# Altium project ESP32SSMB V1.4 .PrjPcb (part 2 of 2)

## Sheet ESP32.SchDoc: ESP32 S3 Schematic
size A3; ApprovedBy: TVBac; SheetNumber: 2; SheetTotal: 6
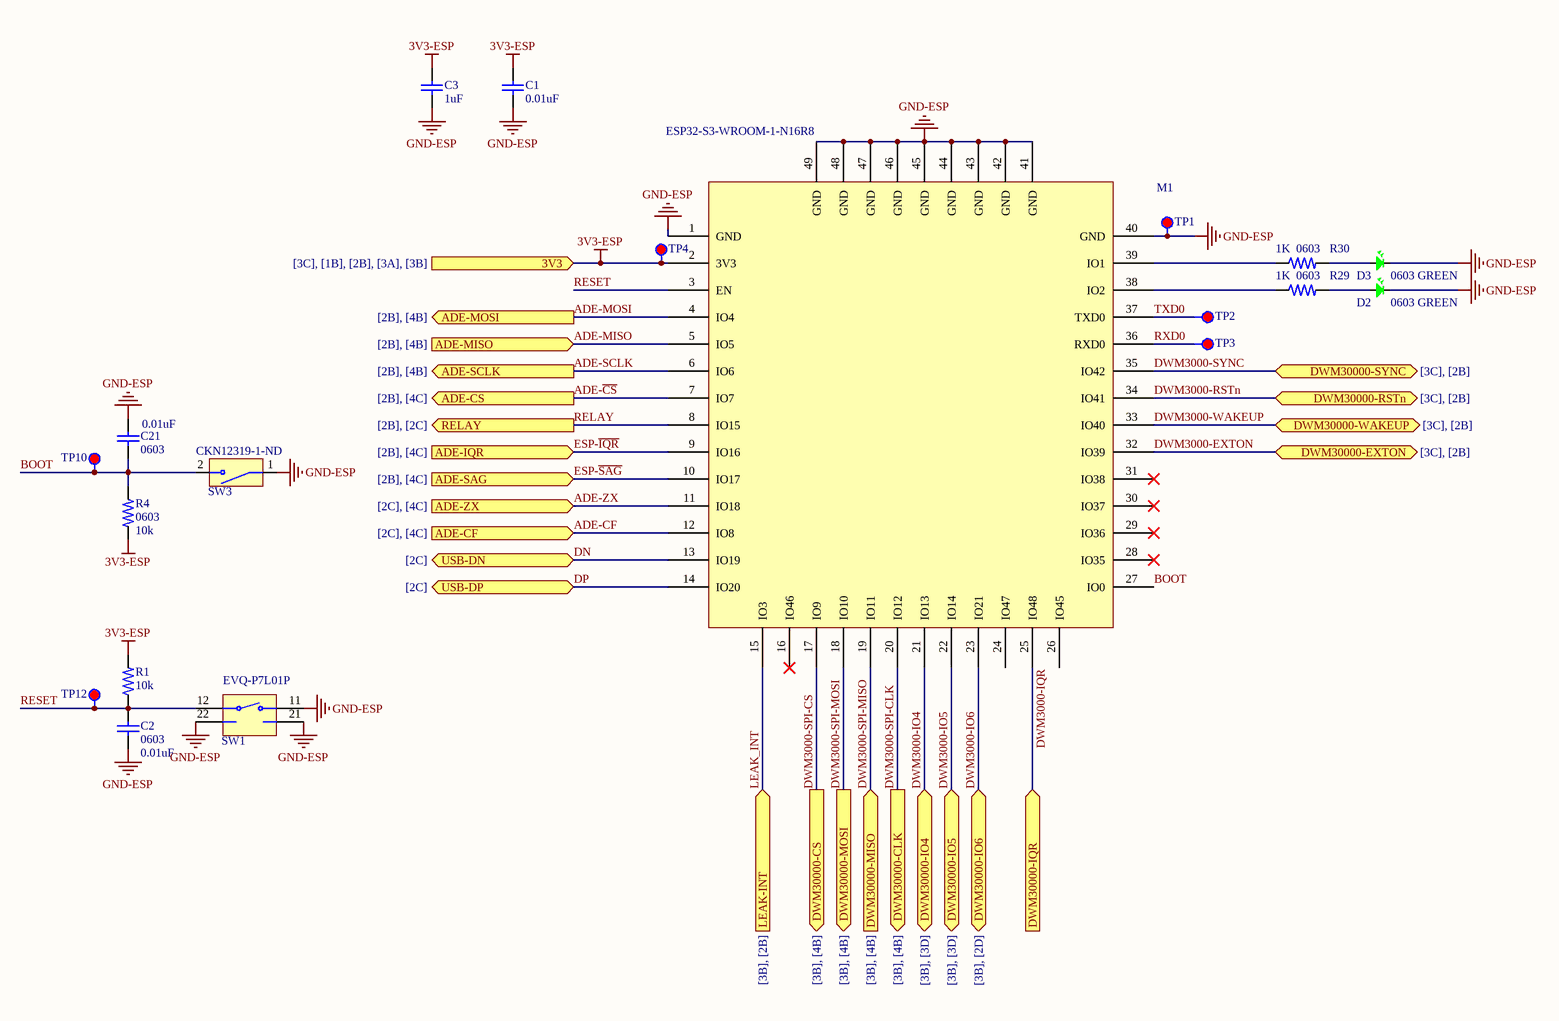
[diagram p3: ESP32.SchDoc]

### Parts
C1  value 0.01uF  [SMD-CAP-0603-YAGEO]  (hidden comment: 0.1 µF ±10% 10V Ceramic Capacitor X7R 0603 (1608 Metric))
C2  value 0.01uF  Package: 0603  [SMD-CAP-0603-YAGEO]  (hidden comment: 10000 pF ±10% 16V Ceramic Capacitor X7R 0603 (1608 Metric))
C3  value 1uF  [SMD-CAP-0603-YAGEO]  (hidden comment: 1 µF ±10% 16V Ceramic Capacitor X7R 0603 (1608 Metric))
C21  value 0.01uF  Package: 0603  [SMD-CAP-0603-YAGEO]  (hidden comment: 10000 pF ±10% 16V Ceramic Capacitor X7R 0603 (1608 Metric))
D2  0603 GREEN  [LED0603_GREEN]
D3  0603 GREEN  [LED0603_GREEN]
M1  Manufacturer Part Number: ESP32-S3-WROOM-1-N16R8  [MODULE-ESP32-S3-WROOM-1-N16R8]  (hidden comment: Bluetooth, WiFi 802.11b/g/n, Bluetooth v4.2 +EDR Transceiver Module 2.4GHz ~ 2.5GHz PCB Trace Surface Mount)
R1  value 10k  [SMD-RES-0603-SEI]  (hidden comment: 10 kOhms ±1% 0.25W, 1/4W Chip Resistor 0603 (1608 Metric) Automotive AEC-Q200, Pulse Withstanding Thick Film)
R4  value 10k  Package: 0603  [SMD-RES-0603-SEI]  (hidden comment: 10 kOhms ±1% 0.25W, 1/4W Chip Resistor 0603 (1608 Metric) Automotive AEC-Q200, Pulse Withstanding Thick Film)
R29  value 1K  Package: 0603  [SMD-RES-0603-SEI]  (hidden comment: 1 kOhms ±1% 0.25W, 1/4W Chip Resistor 0603 (1608 Metric) Automotive AEC-Q200, Pulse Withstanding Thick Film)
R30  value 1K  Package: 0603  [SMD-RES-0603-SEI]  (hidden comment: 1 kOhms ±1% 0.25W, 1/4W Chip Resistor 0603 (1608 Metric) Automotive AEC-Q200, Pulse Withstanding Thick Film)
SW1  MP: EVQ-P7L01P  [SW-HxLxW-1.1x3.5x2.9-PEC]  (hidden comment: https://www.digikey.com/en/products/detail/panasonic-electronic-components/EVQ-P7L01P/4429453)
SW3  Supplier Part Number: CKN12319-1-ND  [SW-HxLxW-5.0x6.0x3.5-C&K]  (hidden comment: Tactile Switch SPST-NO Top Actuated Surface Mount)
TP1  Test Point  [TEST_POINT]  (value not drawn)
TP2  Test Point  [TEST_POINT]  (value not drawn)
TP3  Test Point  [TEST_POINT]  (value not drawn)
TP4  Test Point  [TEST_POINT]  (value not drawn)
TP10  Test Point  [TEST_POINT]  (value not drawn)
TP12  Test Point  [TEST_POINT]  (value not drawn)

### Ports
3V3 (in, see [3C], [1B], [2B], [3A], [3B]), ADE-CF (in, see [2C], [4C]), ADE-CS (out, see [2B], [4C]), ADE-IQR (in, see [2B], [4C]), ADE-MISO (in, see [2B], [4B]), ADE-MOSI (out, see [2B], [4B]), ADE-SAG (in, see [2B], [4C]), ADE-SCLK (out, see [2B], [4B]), ADE-ZX (in, see [2C], [4C]), DWM30000-CLK (out, see [3B], [4B]), DWM30000-CS (out, see [3B], [4B]), DWM30000-EXTON (bidir, see [3C], [2B]), DWM30000-IO4 (bidir, see [3B], [3D]), DWM30000-IO5 (bidir, see [3B], [3D]), DWM30000-IO6 (bidir, see [3B], [2D]), DWM30000-IQR (in), DWM30000-MISO (in, see [3B], [4B]), DWM30000-MOSI (out, see [3B], [4B]), DWM30000-RSTn (bidir, see [3C], [2B]), DWM30000-SYNC (bidir, see [3C], [2B]), DWM30000-WAKEUP (bidir, see [3C], [2B]), LEAK-INT (in, see [3B], [2B]), RELAY (out, see [2B], [2C]), USB-DN (bidir, see [2C]), USB-DP (bidir, see [2C])

### Nets
3V3-ESP: C1.2 C3.2 M1.2(3V3) R1.2 R4.2 TP4.1 ; port 3V3
GND-ESP: C1.1 C2.1 C3.1 C21.1 D2.2 D3.2 M1.1(GND) M1.40(GND) M1.41(GND) M1.42(GND) M1.43(GND) M1.44(GND) M1.45(GND) M1.46(GND) M1.47(GND) M1.48(GND) M1.49(GND) SW1.11 SW1.21 SW1.22 SW3.1(COM) TP1.1
ADE-~{CS}: M1.7(IO7) ; port ADE-CS
ADE-CF: M1.12(IO8) ; port ADE-CF
ADE-MISO: M1.5(IO5) ; port ADE-MISO
ADE-MOSI: M1.4(IO4) ; port ADE-MOSI
ADE-SCLK: M1.6(IO6) ; port ADE-SCLK
ADE-ZX: M1.11(IO18) ; port ADE-ZX
BOOT: C21.2 M1.27(IO0) R4.1 SW3.2(NO) TP10.1
DN: M1.13(IO19) ; port USB-DN
DP: M1.14(IO20) ; port USB-DP
DWM3000-EXTON: M1.32(IO39) ; port DWM30000-EXTON
DWM3000-IO4: M1.21(IO13) ; port DWM30000-IO4
DWM3000-IO5: M1.22(IO14) ; port DWM30000-IO5
DWM3000-IO6: M1.23(IO21) ; port DWM30000-IO6
DWM3000-IQR: M1.25(IO48) ; port DWM30000-IQR
DWM3000-RSTn: M1.34(IO41) ; port DWM30000-RSTn
DWM3000-SPI-CLK: M1.20(IO12) ; port DWM30000-CLK
DWM3000-SPI-CS: M1.17(IO9) ; port DWM30000-CS
DWM3000-SPI-MISO: M1.19(IO11) ; port DWM30000-MISO
DWM3000-SPI-MOSI: M1.18(IO10) ; port DWM30000-MOSI
DWM3000-SYNC: M1.35(IO42) ; port DWM30000-SYNC
DWM3000-WAKEUP: M1.33(IO40) ; port DWM30000-WAKEUP
ESP-~{IQR}: M1.9(IO16) ; port ADE-IQR
ESP-~{SAG}: M1.10(IO17) ; port ADE-SAG
LEAK_INT: M1.15(IO3) ; port LEAK-INT
RELAY: M1.8(IO15) ; port RELAY
RESET: C2.2 M1.3(EN) R1.1 SW1.12 TP12.1
RXD0: M1.36(RXD0) TP3.1
TXD0: M1.37(TXD0) TP2.1
NetD2_1: D2.1 R29.2
NetD3_1: D3.1 R30.2
NetM1_38: M1.38(IO2) R29.1
NetM1_39: M1.39(IO1) R30.1

Not connected (* = marked no-connect by the designer): M1 16(IO46)* 24(IO47) 26(IO45) 28(IO35)* 29(IO36)* 30(IO37)* 31(IO38)*

### Library data of the parts
C1 = CAP; 0.1uF; 10V; 0603; SMD; CC0603KRX7R6BB104: Multilayer Ceramic Capacitor, 0.1 uF, 10 V, ± 10%, X7R, 0603 [1608 Metric]; Manufacturer: Yageo; Material: 4241ConductorMaterial; Designer: TVBac; Supplier: Digikey; Supplier Part Number: 311-4055-1-ND; Manufacturer Part Number: CC0603KRX7R6BB104; RoHS: Yes; Category: Ceramic Capacitors; Stock: 113177; Pricing: 1=0.1, 10=0.067, 50=0.0398, 100=0.0314, 500=0.02316, 1000=0.01918, 4000=0.01633, 8000=0.01519, 12000=0.01443, 28000=0.01367, 100000=0.01035, 200000=0.0101, 400000=0.00949 (USD); Lead Free: 5697LeadFree; Halogen Free: 5694HalogenFree; ComponentLink1URL: https://datasheet.ciiva.com/11586/upy-gphc-x7r-6-3v-to-50v-8-11586327.pdf?src-supplier=Avnet; ComponentLink1Description: https://datasheet.ciiva.com/11586/upy-gphc-x7r-6-3v-to-50v-8-11586327.pdf?src-supplier=Avnet; ComponentLink2Description: Link Digikey; ComponentLink2URL: https://www.digikey.com/en/products/detail/yageo/CC0603KRX7R6BB104/5883741
C2 C21 = CAP; 0.01uF; 16V; 0603; SMD; CC0603KRX7R7BB103: Multilayer Ceramic Capacitor, 0.01 uF, 16 V, ± 10%, X7R, 0603 [1608 Metric]; Manufacturer: Yageo; Material: 4241ConductorMaterial; Designer: TVBac; Supplier: Digikey; Supplier Part Number: 311-3369-1-ND; Manufacturer Part Number: CC0603KRX7R7BB103; RoHS: Yes; Category: Ceramic Capacitors; Stock: 24661; Pricing: 1=0.1, 10=0.041, 50=0.0236, 100=0.0183, 500=0.01378, 1000=0.01083 (USD); Lead Free: 5697LeadFree; ComponentLink1URL: https://datasheet.ciiva.com/7978/1489800-7978139.pdf?src-supplier=Element14; ComponentLink1Description: https://datasheet.ciiva.com/7978/1489800-7978139.pdf?src-supplier=Element14; ComponentLink2Description: Link Digikey; ComponentLink2URL: https://www.digikey.com/en/products/detail/yageo/CC0603KRX7R7BB103/5883753
C3 = CAP; 1uF; 16V; 0603; SMD; CC0603KRX7R7BB105: 0603 1 uF 16 V ±10 % Tolerance X7R SMT Multilayer Ceramic Capacitor; Manufacturer: Yageo; Material: 4241ConductorMaterial; Dissipation Factor: 5%; Designer: TVBac; Supplier: Digikey; Supplier Part Number: 311-1446-1-ND; Manufacturer Part Number: CC0603KRX7R7BB105; RoHS: Yes; Category: Ceramic Capacitors; Stock: 9165861; Pricing: 1=0.1, 10=0.066, 50=0.0392, 100=0.0308, 500=0.02274, 1000=0.01882, 4000=0.01785, 8000=0.01626, 12000=0.01545, 20000=0.01456, 28000=0.01404, 40000=0.01353, 100000=0.01313 (USD); Mounting Technology: Surface Mount; Case/Package: 0603; Pins: 2; Case Code (Metric): 1608; Case Code (Imperial): 0603; Min Operating Temperature: -55°C; Max Operating Temperature: 125°C; Tolerance: 10%; Voltage Rating: 16V; Package Quantity: 1; Packaging: Tape and Reel; Voltage Rating (DC): 16V; Dielectric: X7R; Termination: SMD/SMT; Voltage: 16V; Series: CC; Construction: Flat; Length: 1.6mm; Width: 0.031inch; Height: 0.8mm; Thickness: 0.035inch; Depth: 0.8mm; Radiation Hardening: No; RoHS Compliant: Yes; Reach SVHC Compliant: Unknown; Lead Free: 5697LeadFree; Halogen Free: 5694HalogenFree; ComponentLink1URL: https://datasheet.ciiva.com/8033/1734573-8033801.pdf?src-supplier=Element14; ComponentLink1Description: https://datasheet.ciiva.com/8033/1734573-8033801.pdf?src-supplier=Element14; ComponentLink2URL: https://datasheet.ciiva.com/8033/1734573-8033800.pdf?src-supplier=Element14; ComponentLink2Description: https://datasheet.ciiva.com/8033/1734573-8033800.pdf?src-supplier=Element14; ComponentLink3URL: https://datasheet.ciiva.com/7978/1489800-7978143.pdf?src-supplier=Element14; ComponentLink3Description: https://datasheet.ciiva.com/7978/1489800-7978143.pdf?src-supplier=Element14; ComponentLink4URL: https://datasheet.ciiva.com/28450/1489800-28450557.pdf?src-supplier=Element14; ComponentLink4Description: https://datasheet.ciiva.com/28450/1489800-28450557.pdf?src-supplier=Element14; ComponentLink5URL: https://datasheet.ciiva.com/176/mlccorderingcode-176789.pdf?src-supplier=Digikey; ComponentLink5Description: https://datasheet.ciiva.com/176/mlccorderingcode-176789.pdf?src-supplier=Digikey; ComponentLink6URL: https://datasheet.ciiva.com/176/mlccorderingcode-176788.pdf?src-supplier=Digikey; ComponentLink6Description: https://datasheet.ciiva.com/176/mlccorderingcode-176788.pdf?src-supplier=Digikey; ComponentLink7URL: https://datasheet.ciiva.com/176/mlccorderingcode-176790.pdf?src-supplier=Digikey; ComponentLink7Description: https://datasheet.ciiva.com/176/mlccorderingcode-176790.pdf?src-supplier=Digikey; ComponentLink8URL: https://datasheet.ciiva.com/5425/upy-gphc-x7r-6-3v-to-50v-8-12304-5425495.pdf?src-supplier=Mouser; ComponentLink8Description: https://datasheet.ciiva.com/5425/upy-gphc-x7r-6-3v-to-50v-8-12304-5425495.pdf?src-supplier=Mouser; ComponentLink9Description: Link Digikey; ComponentLink9URL: https://www.digikey.com/en/products/detail/yageo/CC0603KRX7R7BB105/2833611?s=N4IgTCBcDaIMJwAwDZEGYDSAlAGgdizwCEiBGRAVhAF0BfIA
D2 D3 = L0603_GREEN: 225mcd~450mcd Colorless Transparent Lens -40℃~+85℃ Positive Stick 520nm~535nm Green 120° 70mW 2.4V~3V 0603 LED Indication - Discrete ROHS; Manufacturer: Amicc; Manufacture Part Number: A-SP192DGHC-C01-4T; Packaging: Cut Tape (CT); Link: https://www.lcsc.com/product-detail/LED-Indication-Discrete_Amicc-A-SP192DGHC-C01-4T_C19171301.html?s_z=n_LED%200603%20green; Package: 0603
M1 = ESP32-S3-WROOM-1-N16R8; SMD;: SMD mod, ESP32-S3R8 with 3.3V, 8MB Octal PSRAM die insid, 6MBQuad SPI flash, pcb ant; Manufacturer: Espressif Systems; Designer: TVBac; Supplier: Digikey; Supplier Part Number: 1965-ESP32-S3-WROOM-1-N16R8CT-ND; RoHS: No; Category: LDO; Stock: 8003; Pricing: 1=3.9 (USD); ComponentLink1Description: Link Digikey; ComponentLink1URL: https://www.digikey.com/en/products/detail/espressif-systems/ESP32-S3-WROOM-1-N16R8/16162642
R1 R4 = RES; 10K; 0603; SMD; ESR03EZPF1002: SMD Chip Resistor, 10 kOhm, ± 1%, 250 mW, 0603 [1608 Metric], Thick Film, Anti-Surge; Manufacturer: Rohm; Power Rating: 250mW; Temperature Coefficient: 100ppm/°C; Voltage Rating (DC): 150V; Designer: TVBac; Supplier: Digikey; Supplier Part Number: RHM10KADCT-ND; Manufacturer Part Number: ESR03EZPF1002; RoHS: Yes; Category: Chip SMD Resistors; Stock: 2136779; Pricing: 1=0.16, 10=0.078, 50=0.0516, 100=0.044, 500=0.03138, 1000=0.02764 (USD); Case/Package: 0603; Case Code (Metric): 1608; Case Code (Imperial): 0603; Min Operating Temperature: -55°C; Max Operating Temperature: 155°C; Tolerance: 1%; Package Quantity: 1; Packaging: Cut Tape; Number of Terminations: 2; Max Power Dissipation: 250mW; Features: Automotive AEC-Q200; Series: ESR; Length: 0.063inch; Width: 0.031inch; Height: 0.022inch; Ratings: AEC-Q200; RoHS Compliant: Yes; Lead Free: 5697LeadFree; ComponentLink1URL: https://datasheet.ciiva.com/2469/esr-2469710.pdf?src-supplier=Digikey; ComponentLink1Description: https://datasheet.ciiva.com/2469/esr-2469710.pdf?src-supplier=Digikey; ComponentLink2URL: https://datasheet.ciiva.com/2469/esr-2469711.pdf?src-supplier=Digikey; ComponentLink2Description: https://datasheet.ciiva.com/2469/esr-2469711.pdf?src-supplier=Digikey; ComponentLink3URL: https://datasheet.ciiva.com/2469/esr-2469709.pdf?src-supplier=Digikey; ComponentLink3Description: https://datasheet.ciiva.com/2469/esr-2469709.pdf?src-supplier=Digikey; ComponentLink4Description: Link Digikey; ComponentLink4URL: https://www.digikey.com/en/products/detail/rohm-semiconductor/ESR03EZPF1002/1983429
R29 R30 = RES; 1K; 0603; SMD; ESR03EZPF1001: SMD Chip Resistor, 1 kOhm, ± 1%, 250 mW, 0603 [1608 Metric], Thick Film, Anti-Surge; Manufacturer: Rohm; Voltage Rating: 150V; Designer: TVBac; Supplier: Digikey; Supplier Part Number: RHM1.00KADCT-ND; Manufacturer Part Number: ESR03EZPF1001; RoHS: Yes; Category: Chip SMD Resistors; Stock: 2703233; Pricing: 1=0.11, 10=0.055, 50=0.0364, 100=0.0309, 500=0.02206, 1000=0.01943 (USD); Voltage Rating (DC): 150V; Lead Free: 5697LeadFree; ComponentLink1URL: https://datasheet.ciiva.com/2469/esr-2469712.pdf?src-supplier=Digikey; ComponentLink1Description: https://datasheet.ciiva.com/2469/esr-2469712.pdf?src-supplier=Digikey; ComponentLink2URL: https://datasheet.ciiva.com/2469/esr-2469713.pdf?src-supplier=Digikey; ComponentLink2Description: https://datasheet.ciiva.com/2469/esr-2469713.pdf?src-supplier=Digikey; ComponentLink3URL: https://datasheet.ciiva.com/2469/esr-2469714.pdf?src-supplier=Digikey; ComponentLink3Description: https://datasheet.ciiva.com/2469/esr-2469714.pdf?src-supplier=Digikey; ComponentLink4Description: Link Digikey; ComponentLink4URL: https://www.digikey.com/en/products/detail/rohm-semiconductor/ESR03EZPF1001/1983428
SW1 = BUT; SW; SMD; EVQ-P7L01P: Tactile Switch SPST-NO Side Actuated Surface Mount, Right Angle; MF: Panasonic Electronic Components; SnapEDA_Link: https://www.snapeda.com/parts/EVQ-P7L01P/Panasonic+Electronic+Components/view-part/?ref=snap; Package: None; Check_prices: https://www.snapeda.com/parts/EVQ-P7L01P/Panasonic+Electronic+Components/view-part/?ref=eda; Purchase-URL: https://pricing.snapeda.com/search/part/EVQ-P7L01P/?ref=eda; Digi-Key_Part_Number: P16769TR-ND; Value: *
SW3 = BUT; SW; SMD; PTS636SM50JSMTRLFS: Switch Tactile N.O. SPST Rectangular Button J-Bend 0.05A 12VDC 1.77N SMD T/R; Manufacturer: ITT C&K; Contact Resistance: 100mR; Number of Positions: 2NUMBER; Supplier: Digikey; Manufacturer Part Number: PTS636SM50JSMTRLFS; RoHS: No; Category: Tactile Switches; Stock: 80725; Pricing: 1=0.21, 10=0.199, 25=0.1888, 100=0.1717, 250=0.1614, 500=0.14766 (USD); ComponentLink1Description: Link Digikey; ComponentLink1URL: https://www.digikey.com/en/products/detail/c-k/PTS636-SM50J-SMTR-LFS/10071732
TP1-TP4 TP10 TP12 = TEST_POINT

## Sheet UWB.SchDoc
size A4; SheetNumber: 6; SheetTotal: 6
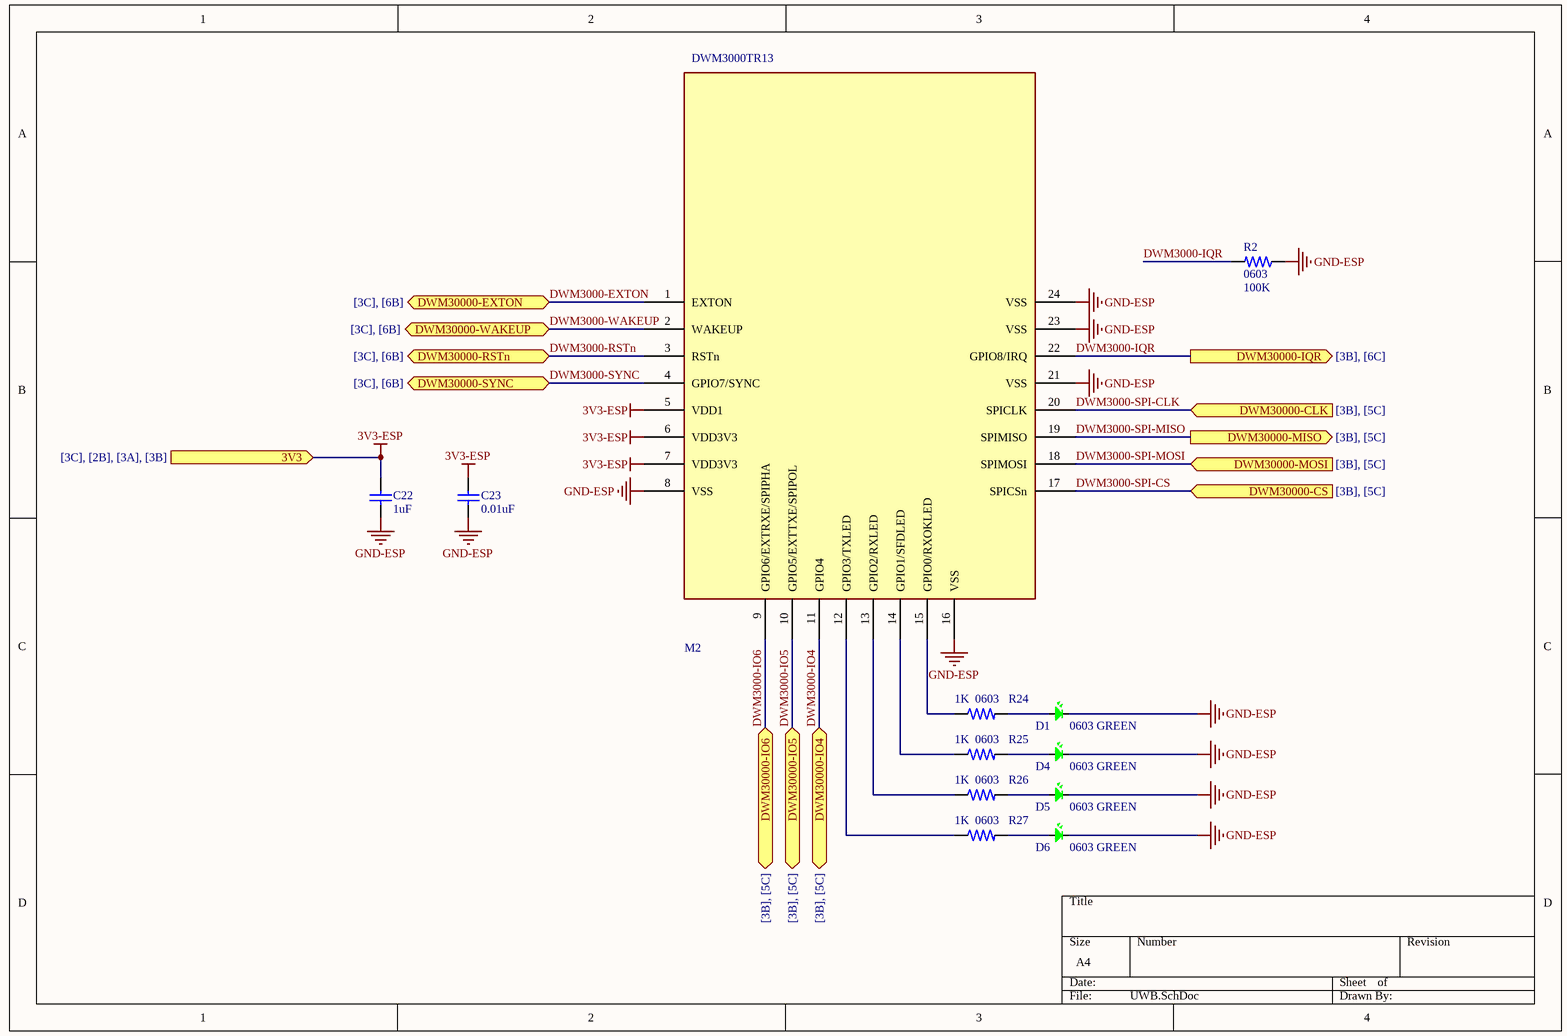
[diagram p4: UWB.SchDoc]

### Parts
C22  value 1uF  [SMD-CAP-0603-YAGEO]  (hidden comment: 1 µF ±10% 16V Ceramic Capacitor X7R 0603 (1608 Metric))
C23  value 0.01uF  [SMD-CAP-0603-YAGEO]  (hidden comment: 0.1 µF ±10% 10V Ceramic Capacitor X7R 0603 (1608 Metric))
D1  0603 GREEN  [LED0603_GREEN]
D4  0603 GREEN  [LED0603_GREEN]
D5  0603 GREEN  [LED0603_GREEN]
D6  0603 GREEN  [LED0603_GREEN]
M2  802.15.4, Bluetooth, Cellular UWB, Zigbee® Transceiver Module 6.25GHz ~ 8.25GHz Integrated, Ceramic Patch Surface Mount  [MODULE-DWM3000SR]  (value not drawn)
R2  value 100K  Package: 0603  [SMD-RES-0603-SEI]  (hidden comment: 100 kOhms ±5% 0.25W, 1/4W Chip Resistor 0603 (1608 Metric) Automotive AEC-Q200, Pulse Withstanding Thick Film)
R24  value 1K  Package: 0603  [SMD-RES-0603-SEI]  (hidden comment: 1 kOhms ±1% 0.25W, 1/4W Chip Resistor 0603 (1608 Metric) Automotive AEC-Q200, Pulse Withstanding Thick Film)
R25  value 1K  Package: 0603  [SMD-RES-0603-SEI]  (hidden comment: 1 kOhms ±1% 0.25W, 1/4W Chip Resistor 0603 (1608 Metric) Automotive AEC-Q200, Pulse Withstanding Thick Film)
R26  value 1K  Package: 0603  [SMD-RES-0603-SEI]  (hidden comment: 1 kOhms ±1% 0.25W, 1/4W Chip Resistor 0603 (1608 Metric) Automotive AEC-Q200, Pulse Withstanding Thick Film)
R27  value 1K  Package: 0603  [SMD-RES-0603-SEI]  (hidden comment: 1 kOhms ±1% 0.25W, 1/4W Chip Resistor 0603 (1608 Metric) Automotive AEC-Q200, Pulse Withstanding Thick Film)

### Ports
3V3 (in, see [3C], [2B], [3A], [3B]), DWM30000-CLK (in, see [3B], [5C]), DWM30000-CS (in, see [3B], [5C]), DWM30000-EXTON (bidir, see [3C], [6B]), DWM30000-IO4 (bidir, see [3B], [5C]), DWM30000-IO5 (bidir, see [3B], [5C]), DWM30000-IO6 (bidir, see [3B], [5C]), DWM30000-IQR (out, see [3B], [6C]), DWM30000-MISO (out, see [3B], [5C]), DWM30000-MOSI (in, see [3B], [5C]), DWM30000-RSTn (bidir, see [3C], [6B]), DWM30000-SYNC (bidir, see [3C], [6B]), DWM30000-WAKEUP (bidir, see [3C], [6B])

### Nets
3V3-ESP: C22.2 C23.2 M2.5(VDD1) M2.6(VDD3V3) M2.7(VDD3V3) ; port 3V3
GND-ESP: C22.1 C23.1 D1.2 D4.2 D5.2 D6.2 M2.8(VSS) M2.16(VSS) M2.21(VSS) M2.23(VSS) M2.24(VSS) R2.1
DWM3000-EXTON: M2.1(EXTON) ; port DWM30000-EXTON
DWM3000-IO4: M2.11(GPIO4) ; port DWM30000-IO4
DWM3000-IO5: M2.10(GPIO5/EXTTXE/SPIPOL) ; port DWM30000-IO5
DWM3000-IO6: M2.9(GPIO6/EXTRXE/SPIPHA) ; port DWM30000-IO6
DWM3000-IQR: M2.22(GPIO8/IRQ) R2.2 ; port DWM30000-IQR
DWM3000-RSTn: M2.3(RSTn) ; port DWM30000-RSTn
DWM3000-SPI-CLK: M2.20(SPICLK) ; port DWM30000-CLK
DWM3000-SPI-CS: M2.17(SPICSn) ; port DWM30000-CS
DWM3000-SPI-MISO: M2.19(SPIMISO) ; port DWM30000-MISO
DWM3000-SPI-MOSI: M2.18(SPIMOSI) ; port DWM30000-MOSI
DWM3000-SYNC: M2.4(GPIO7/SYNC) ; port DWM30000-SYNC
DWM3000-WAKEUP: M2.2(WAKEUP) ; port DWM30000-WAKEUP
NetD1_1: D1.1 R24.2
NetD4_1: D4.1 R25.2
NetD5_1: D5.1 R26.2
NetD6_1: D6.1 R27.2
NetM2_12: M2.12(GPIO3/TXLED) R27.1
NetM2_13: M2.13(GPIO2/RXLED) R26.1
NetM2_14: M2.14(GPIO1/SFDLED) R25.1
NetM2_15: M2.15(GPIO0/RXOKLED) R24.1

### Library data of the parts
C22 = CAP; 1uF; 16V; 0603; SMD; CC0603KRX7R7BB105: as C3 on sheet ESP32; Supplier: Digikey; Supplier Part Number: 311-1446-1-ND; Manufacturer Part Number: CC0603KRX7R7BB105; RoHS: Yes; Category: Ceramic Capacitors; Stock: 9165861; Pricing: 1=0.1, 10=0.066, 50=0.0392, 100=0.0308, 500=0.02274, 1000=0.01882, 4000=0.01785, 8000=0.01626, 12000=0.01545, 20000=0.01456, 28000=0.01404, 40000=0.01353, 100000=0.01313 (USD); Mounting Technology: Surface Mount; Case/Package: 0603; Pins: 2; Case Code (Metric): 1608; Case Code (Imperial): 0603; Min Operating Temperature: -55°C; Max Operating Temperature: 125°C; Tolerance: 10%; Voltage Rating: 16V; Package Quantity: 1; Packaging: Tape and Reel; Voltage Rating (DC): 16V; Dielectric: X7R; Termination: SMD/SMT; Voltage: 16V; Series: CC; Construction: Flat; Length: 1.6mm; Width: 0.031inch; Height: 0.8mm; Thickness: 0.035inch; Depth: 0.8mm; Radiation Hardening: No; RoHS Compliant: Yes; Reach SVHC Compliant: Unknown; Lead Free: 5697LeadFree; Halogen Free: 5694HalogenFree; ComponentLink1URL: https://datasheet.ciiva.com/8033/1734573-8033801.pdf?src-supplier=Element14; ComponentLink1Description: https://datasheet.ciiva.com/8033/1734573-8033801.pdf?src-supplier=Element14; ComponentLink2URL: https://datasheet.ciiva.com/8033/1734573-8033800.pdf?src-supplier=Element14; ComponentLink2Description: https://datasheet.ciiva.com/8033/1734573-8033800.pdf?src-supplier=Element14; ComponentLink3URL: https://datasheet.ciiva.com/7978/1489800-7978143.pdf?src-supplier=Element14; ComponentLink3Description: https://datasheet.ciiva.com/7978/1489800-7978143.pdf?src-supplier=Element14; ComponentLink4URL: https://datasheet.ciiva.com/28450/1489800-28450557.pdf?src-supplier=Element14; ComponentLink4Description: https://datasheet.ciiva.com/28450/1489800-28450557.pdf?src-supplier=Element14; ComponentLink5URL: https://datasheet.ciiva.com/176/mlccorderingcode-176789.pdf?src-supplier=Digikey; ComponentLink5Description: https://datasheet.ciiva.com/176/mlccorderingcode-176789.pdf?src-supplier=Digikey; ComponentLink6URL: https://datasheet.ciiva.com/176/mlccorderingcode-176788.pdf?src-supplier=Digikey; ComponentLink6Description: https://datasheet.ciiva.com/176/mlccorderingcode-176788.pdf?src-supplier=Digikey; ComponentLink7URL: https://datasheet.ciiva.com/176/mlccorderingcode-176790.pdf?src-supplier=Digikey; ComponentLink7Description: https://datasheet.ciiva.com/176/mlccorderingcode-176790.pdf?src-supplier=Digikey; ComponentLink8URL: https://datasheet.ciiva.com/5425/upy-gphc-x7r-6-3v-to-50v-8-12304-5425495.pdf?src-supplier=Mouser; ComponentLink8Description: https://datasheet.ciiva.com/5425/upy-gphc-x7r-6-3v-to-50v-8-12304-5425495.pdf?src-supplier=Mouser; ComponentLink9Description: Link Digikey; ComponentLink9URL: https://www.digikey.com/en/products/detail/yageo/CC0603KRX7R7BB105/2833611?s=N4IgTCBcDaIMJwAwDZEGYDSAlAGgdizwCEiBGRAVhAF0BfIA
C23 = CAP; 0.1uF; 10V; 0603; SMD; CC0603KRX7R6BB104: as C1 on sheet ESP32; Supplier: Digikey; Supplier Part Number: 311-4055-1-ND; Manufacturer Part Number: CC0603KRX7R6BB104; RoHS: Yes; Category: Ceramic Capacitors; Stock: 113177; Pricing: 1=0.1, 10=0.067, 50=0.0398, 100=0.0314, 500=0.02316, 1000=0.01918, 4000=0.01633, 8000=0.01519, 12000=0.01443, 28000=0.01367, 100000=0.01035, 200000=0.0101, 400000=0.00949 (USD); Lead Free: 5697LeadFree; Halogen Free: 5694HalogenFree; ComponentLink1URL: https://datasheet.ciiva.com/11586/upy-gphc-x7r-6-3v-to-50v-8-11586327.pdf?src-supplier=Avnet; ComponentLink1Description: https://datasheet.ciiva.com/11586/upy-gphc-x7r-6-3v-to-50v-8-11586327.pdf?src-supplier=Avnet; ComponentLink2Description: Link Digikey; ComponentLink2URL: https://www.digikey.com/en/products/detail/yageo/CC0603KRX7R6BB104/5883741
D1 D4-D6 = L0603_GREEN: as D2 on sheet ESP32; Packaging: Cut Tape (CT); Link: https://www.lcsc.com/product-detail/LED-Indication-Discrete_Amicc-A-SP192DGHC-C01-4T_C19171301.html?s_z=n_LED%200603%20green; Package: 0603
M2 = DWM3000TR13: RF Modules UWB XCVR Module; Manufacturer: Qorvo; Interface: SPI; Bandwidth: 1.4976GHz; Data Rate: 6.8Mbps; Clock Frequency: 7.9872GHz; Max Supply Voltage: 3.6V; Min Supply Voltage: 1.62V; Number of GPIO: 9; Supplier: Mouser; Supplier Part Number: 772-DWM3000TR13; Manufacturer Part Number: DWM3000TR13; RoHS: No; Category: RF Receivers, Transceivers; Stock: 8278; Pricing: 1=23.62, 10=23.62, 50=20.19, 100=17.18, 1000=12.71, 10000=12.71 (USD); Min Operating Temperature: -30°C; Max Operating Temperature: 85°C; Height: 2.9mm
R2 = RES; 100K; 0603; SMD; ESR03EZPJ104: Res Thick Film 0603 100K Ohm 5% 0.25W(1/4W) ±200ppm/C Pad SMD Automotive T/R; Manufacturer: Rohm; Voltage Rating: 150V; Designer: TVBac; Supplier: Digikey; Supplier Part Number: RHM100KDCT-ND; Manufacturer Part Number: ESR03EZPJ104; RoHS: Yes; Category: Chip SMD Resistors; Stock: 165361; Pricing: 1=0.1, 10=0.048, 50=0.0312, 100=0.0265, 500=0.0188, 1000=0.0165 (USD); Voltage Rating (DC): 150V; Lead Free: 5697LeadFree; ComponentLink1URL: https://datasheet.ciiva.com/14924/esr-14924811.pdf?src-supplier=Digikey; ComponentLink1Description: https://datasheet.ciiva.com/14924/esr-14924811.pdf?src-supplier=Digikey; ComponentLink2URL: https://datasheet.ciiva.com/14928/esr-14928813.pdf?src-supplier=Digikey; ComponentLink2Description: https://datasheet.ciiva.com/14928/esr-14928813.pdf?src-supplier=Digikey; ComponentLink3URL: https://datasheet.ciiva.com/14930/esr-14930633.pdf?src-supplier=Digikey; ComponentLink3Description: https://datasheet.ciiva.com/14930/esr-14930633.pdf?src-supplier=Digikey; ComponentLink4Description: Link Digikey; ComponentLink4URL: https://www.digikey.com/en/products/detail/rohm-semiconductor/ESR03EZPJ104/4051180
R24-R27 = RES; 1K; 0603; SMD; ESR03EZPF1001: as R29 on sheet ESP32; Supplier: Digikey; Supplier Part Number: RHM1.00KADCT-ND; Manufacturer Part Number: ESR03EZPF1001; RoHS: Yes; Category: Chip SMD Resistors; Stock: 2703233; Pricing: 1=0.11, 10=0.055, 50=0.0364, 100=0.0309, 500=0.02206, 1000=0.01943 (USD); Voltage Rating (DC): 150V; Lead Free: 5697LeadFree; ComponentLink1URL: https://datasheet.ciiva.com/2469/esr-2469712.pdf?src-supplier=Digikey; ComponentLink1Description: https://datasheet.ciiva.com/2469/esr-2469712.pdf?src-supplier=Digikey; ComponentLink2URL: https://datasheet.ciiva.com/2469/esr-2469713.pdf?src-supplier=Digikey; ComponentLink2Description: https://datasheet.ciiva.com/2469/esr-2469713.pdf?src-supplier=Digikey; ComponentLink3URL: https://datasheet.ciiva.com/2469/esr-2469714.pdf?src-supplier=Digikey; ComponentLink3Description: https://datasheet.ciiva.com/2469/esr-2469714.pdf?src-supplier=Digikey; ComponentLink4Description: Link Digikey; ComponentLink4URL: https://www.digikey.com/en/products/detail/rohm-semiconductor/ESR03EZPF1001/1983428

## Sheet Connector.SchDoc
size A4; SheetNumber: 4; SheetTotal: 6
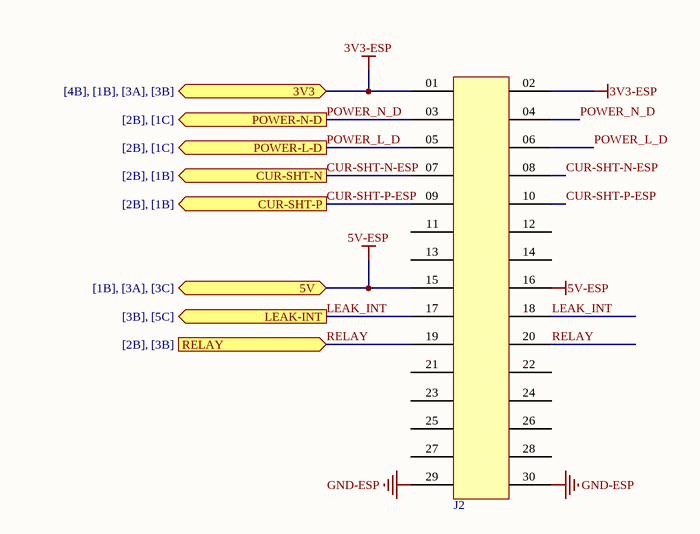
[diagram p5: Connector.SchDoc]

### Parts
J2  HEADER; 15x2PIN; 2.54; HOR;  [HEADER-2.54-15x2-HOR-U3D]  (value not drawn)

### Ports
3V3 (bidir, see [4B], [1B], [3A], [3B]), 5V (bidir, see [1B], [3A], [3C]), CUR-SHT-N (out, see [2B], [1B]), CUR-SHT-P (out, see [2B], [1B]), LEAK-INT (out, see [3B], [5C]), POWER-L-D (out, see [2B], [1C]), POWER-N-D (out, see [2B], [1C]), RELAY (in, see [2B], [3B])

### Nets
3V3-ESP: J2.01 J2.02 ; port 3V3
5V-ESP: J2.15 J2.16 ; port 5V
GND-ESP: J2.29 J2.30
CUR-SHT-N-ESP: J2.07 J2.08 ; port CUR-SHT-N
CUR-SHT-P-ESP: J2.09 J2.10 ; port CUR-SHT-P
LEAK_INT: J2.17 J2.18 ; port LEAK-INT
POWER_L_D: J2.05 J2.06 ; port POWER-L-D
POWER_N_D: J2.03 J2.04 ; port POWER-N-D
RELAY: J2.19 J2.20 ; port RELAY

Not connected (* = marked no-connect by the designer): J2 11 12 13 14 21 22 23 24 25 26 27 28

### Library data of the parts
J2 = HEADER; 15x2PIN; 2.54; HOR;: Designer: TVBac; System: Connector

## Nets that join several sheets
3V3-ESP: ADE7753 (R3.1 R6.1), Power (IC1.4), ESP32 (6 pins), UWB (5 pins), Connector (J2.01 J2.02)
5V-ESP: ADE7753 (5 pins), Power (C19.2 IC1.3 J3.A4B9 J3.B4A9), Connector (J2.15 J2.16)
GND-ESP: ADE7753 (11 pins), Power (5 pins), ESP32 (22 pins), UWB (12 pins), Connector (J2.29 J2.30)
ADE-~{CS}: ADE7753 (R17.2), ESP32 (M1.7)
ADE-CF: ADE7753 (R11.2 R22.2), ESP32 (M1.12)
ADE-MISO: ADE7753 (R7.2 R15.2), ESP32 (M1.5)
ADE-MOSI: ADE7753 (R12.2), ESP32 (M1.4)
ADE-SCLK: ADE7753 (R16.2), ESP32 (M1.6)
ADE-ZX: ADE7753 (R8.2 R21.2), ESP32 (M1.11)
CUR-SHT-N-ESP: ADE7753 (R13.1), Connector (J2.07 J2.08)
CUR-SHT-P-ESP: ADE7753 (R9.1), Connector (J2.09 J2.10)
DN: Power (J3.A7 J3.B7), ESP32 (M1.13)
DP: Power (J3.A6 J3.B6), ESP32 (M1.14)
DWM3000-EXTON: ESP32 (M1.32), UWB (M2.1)
DWM3000-IO4: ESP32 (M1.21), UWB (M2.11)
DWM3000-IO5: ESP32 (M1.22), UWB (M2.10)
DWM3000-IO6: ESP32 (M1.23), UWB (M2.9)
DWM3000-IQR: ESP32 (M1.25), UWB (M2.22 R2.2)
DWM3000-RSTn: ESP32 (M1.34), UWB (M2.3)
DWM3000-SPI-CLK: ESP32 (M1.20), UWB (M2.20)
DWM3000-SPI-CS: ESP32 (M1.17), UWB (M2.17)
DWM3000-SPI-MISO: ESP32 (M1.19), UWB (M2.19)
DWM3000-SPI-MOSI: ESP32 (M1.18), UWB (M2.18)
DWM3000-SYNC: ESP32 (M1.35), UWB (M2.4)
DWM3000-WAKEUP: ESP32 (M1.33), UWB (M2.2)
ESP-~{IQR}: ADE7753 (R18.2), ESP32 (M1.9)
ESP-~{SAG}: ADE7753 (R20.2), ESP32 (M1.10)
LEAK_INT: ESP32 (M1.15), Connector (J2.17 J2.18)
POWER_L_D: ADE7753 (C16.1 R19.1), Connector (J2.05 J2.06)
POWER_N_D: ADE7753 (C18.2 IC3.7 R23.2 TP9.1), Connector (J2.03 J2.04)
RELAY: ESP32 (M1.8), Connector (J2.19 J2.20)